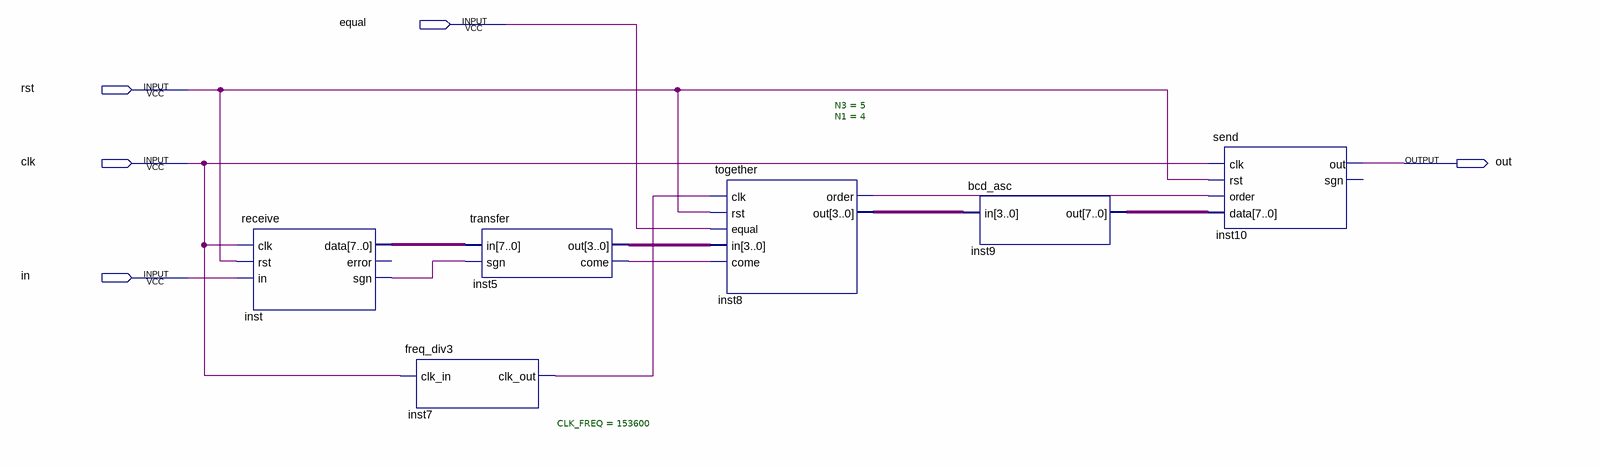
[diagram p0: schematic sheet]
// Quartus schematic retra.bdf as structural Verilog: 6 symbols, 5 pins
module retra (
  input  equal,
  input  rst,
  input  clk,
  input  in,
  output out
);

  wire inst5_come, inst7_clk_out, inst8_order, inst_sgn;
  wire [3:0] inst5_out, inst8_out;
  wire [7:0] inst9_out, inst_data;

  receive inst (.clk(clk), .rst(rst), .in(in), .data(inst_data), .sgn(inst_sgn));  // open: error
  freq_div3 #(.CLK_FREQ(153600)) inst7 (.clk_in(clk), .clk_out(inst7_clk_out));
  transfer inst5 (.in(inst_data), .sgn(inst_sgn), .out(inst5_out), .come(inst5_come));
  together #(.N3(5), .N1(4)) inst8 (
    .clk(inst7_clk_out), .rst(rst), .equal(equal), .in(inst5_out), .come(inst5_come), .order(inst8_order),
    .out(inst8_out));
  bcd_asc inst9 (.in(inst8_out), .out(inst9_out));
  send inst10 (.clk(clk), .rst(rst), .order(inst8_order), .data(inst9_out), .out(out));  // open: sgn
endmodule
